# EAGLE schematic main (EAGLE 8.4.0)
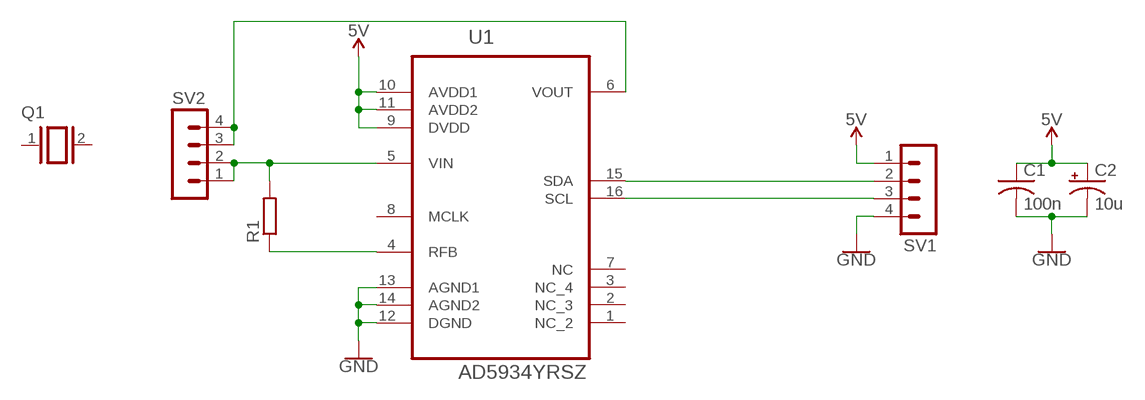
[diagram p0: schematic, sheet 1]

## Parts
C1  100n  C-US025-025X050  [C025-025X050]
C2  10u  CPOL-USE2-5  [E2-5]
Q1  XTAL/S  [QS]
R1  R0204/7  [0204/7]
SV1  MA04-1  [MA04-1]
SV2  MA04-1  [MA04-1]
U1  AD5934YRSZ  [SOP65P780X200-16N]

## Nets
5V: C1.1 C2.+ SV1.1 U1.9(DVDD) U1.10(AVDD1) U1.11(AVDD2)
GND: C1.2 C2.- SV1.4 U1.12(DGND) U1.13(AGND1) U1.14(AGND2)
N$1: SV1.2 U1.15(SDA)
N$2: SV1.3 U1.16(SCL)
N$3: R1.1 U1.4(RFB)
N$4: R1.2 SV2.1 SV2.2 U1.5(VIN)
N$5: SV2.3 SV2.4 U1.6(VOUT)
Unconnected: Q1.1 Q1.2 U1.1(NC_2) U1.2(NC_3) U1.3(NC_4) U1.7(NC) U1.8(MCLK)

## Library data of the parts
C1 = rcl:C-US: CAPACITOR, American symbol
C2 = rcl:CPOL-US: POLARIZED CAPACITOR, American symbol
Q1 = special:XTAL/S: CRYSTAL
R1 = eagle-ltspice:R: RESISTOR, European symbol; SPICEMODEL: NONE; SPICEPREFIX: R
SV1 SV2 = con-lstb:MA04-1: PIN HEADER; OC_FARNELL: unknown; OC_NEWARK: unknown
U1 = ADI-Phase-2:AD5934YRSZ: 250 kSPS 12-Bit Impedance Converter Network Analyzer; MPN: AD5934YRSZ; OC_FARNELL: 1117905; OC_NEWARK: 59K4349; PACKAGE: SSOP-16; SUPPLIER: Analog Devices